# EAGLE schematic bezkontaktowy_miernik_odległości (EAGLE 9.7.0)
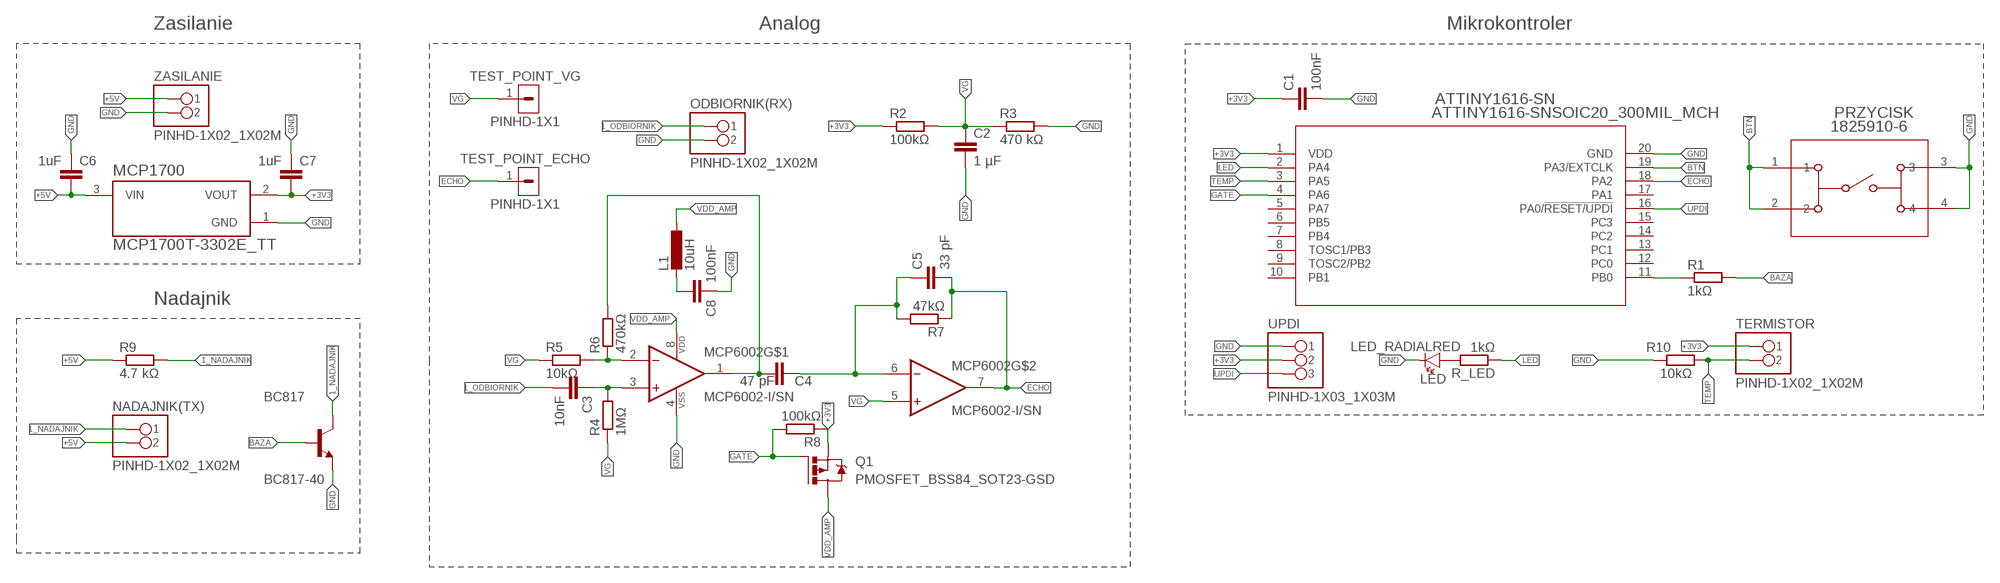
[diagram p0: schematic, sheet 1]

## Parts
ATTINY1616-SN  ATTINY1616-SNSOIC20_300MIL_MCH  [SOIC20_300MIL_MCH]
BC817  BC817-40  [SOT95P240X120-3N]
C1  100nF  C-EUC0603  [C0603]
C2  1 µF  C-EUC0603  [C0603]
C3  10nF  C-EUC0603  [C0603]
C4  47 pF  C-EUC0603  [C0603]
C5  33 pF  C-EUC0603  [C0603]
C6  1uF  C-EUC0603  [C0603]
C7  1uF  C-EUC0603  [C0603]
C8  100nF  C-EUC0603  [C0603]
L1  10uH  L-EU0204/7  [0204/7]
LED  LED_RADIALRED  [LEDRD254W60D565H860B_R]
MCP1700  MCP1700T-3302E_TT  [SOT95P237X112-3N]
MCP6002  MCP6002-I/SN  [SOIC127P600X175-8N]
NADAJNIK(TX)  PINHD-1X02_1X02M  [1X02]
ODBIORNIK(RX)  PINHD-1X02_1X02M  [1X02]
PRZYCISK  1825910-6  [SW4_1825910-B]
Q1  PMOSFET_BSS84_SOT23-GSD  [SOT23]
R1  1kΩ  R-EU_R0603  [R0603]
R2  100kΩ  R-EU_R0603  [R0603]
R3  470 kΩ  R-EU_R0603  [R0603]
R4  1MΩ  R-EU_R0603  [R0603]
R5  10kΩ  R-EU_R0603  [R0603]
R6  470kΩ  R-EU_R0603  [R0603]
R7  47kΩ  R-EU_R0603  [R0603]
R8  100kΩ  R-EU_R0603  [R0603]
R9  4.7 kΩ  R-EU_R0603  [R0603]
R10  10kΩ  R-EU_R0603  [R0603]
R_LED  1kΩ  R-EU_R0603  [R0603]
TERMISTOR  PINHD-1X02_1X02M  [1X02]
TEST_POINT_ECHO  PINHD-1X1  [1X01]
TEST_POINT_VG  PINHD-1X1  [1X01]
UPDI  PINHD-1X03_1X03M  [1X03]
ZASILANIE  PINHD-1X02_1X02M  [1X02]

## Nets
1_NADAJNIK: BC817.3(C) NADAJNIK(TX).1 R9.2
1_ODBIORNIK: C3.2 ODBIORNIK(RX).1
+3V3: ATTINY1616-SN.1(VDD) C1.1 C7.2 MCP1700.2(VOUT) Q1.2(S) R2.1 R8.1 TERMISTOR.1 UPDI.2
+5V: C6.2 MCP1700.3(VIN) NADAJNIK(TX).2 R9.1 ZASILANIE.1
BAZA: BC817.1(B) R1.2
BTN: ATTINY1616-SN.19(PA3/EXTCLK) PRZYCISK.1 PRZYCISK.2
ECHO: ATTINY1616-SN.18(PA2) C5.2 MCP6002.7(VOUTB) R7.1 TEST_POINT_ECHO.1
GATE: ATTINY1616-SN.4(PA6) Q1.1(G) R8.2
GND: ATTINY1616-SN.20(GND) BC817.2(E) C1.2 C2.2 C6.1 C7.1 C8.1 LED.C MCP1700.1(GND) MCP6002.4(VSS) ODBIORNIK(RX).2 PRZYCISK.3 PRZYCISK.4 R3.2 R10.1 UPDI.1 ZASILANIE.2
LED: ATTINY1616-SN.2(PA4) R_LED.1
N$1: C3.1 MCP6002.3(VINA+) R4.2
N$2: MCP6002.2(VINA-) R5.2 R6.1
N$3: C4.2 MCP6002.1(VOUTA) R6.2
N$4: LED.A R_LED.2
N$5: C4.1 C5.1 MCP6002.6(VINB-) R7.2
N$6: C8.2 L1.2
N$8: ATTINY1616-SN.11(PB0) R1.1
TEMP: ATTINY1616-SN.3(PA5) R10.2 TERMISTOR.2
UPDI: ATTINY1616-SN.16(PA0/!RESET/UPDI) UPDI.3
VDD_AMP: L1.1 MCP6002.8(VDD) Q1.3(D)
VG: C2.1 MCP6002.5(VINB+) R2.2 R3.1 R4.1 R5.1 TEST_POINT_VG.1
Unconnected: ATTINY1616-SN.5(PA7) ATTINY1616-SN.6(PB5) ATTINY1616-SN.7(PB4) ATTINY1616-SN.8(TOSC1/PB3) ATTINY1616-SN.9(TOSC2/PB2) ATTINY1616-SN.10(PB1) ATTINY1616-SN.12(PC0) ATTINY1616-SN.13(PC1) ATTINY1616-SN.14(PC2) ATTINY1616-SN.15(PC3) ATTINY1616-SN.17(PA1)

## Notes on the sheet
- Zasilanie | Analog | Mikrokontroler
- Nadajnik

## Library data of the parts
ATTINY1616-SN = ATTINY1616-SN:ATTINY1616-SN; COPYRIGHT: Copyright (C) 2025 Ultra Librarian. All rights reserved.; MANUFACTURER_NAME: Microchip; MANUFACTURER_PART_NUMBER: ATTINY1616-SN
BC817 = SnapEDA Library:BC817-40; MANUFACTURER: Diotec Semiconductor; MAXIMUM_PACKAGE_HEIGHT: 1.2mm; PARTREV: 2023-08-16; STANDARD: IPC 7351B
C1-C8 = rcl:C-EU: CAPACITOR, European symbol; SPICEPREFIX: C
L1 = rcl:L-EU: INDUCTOR, European symbol; SPICEPREFIX: L
LED = Opto-Electronic:LED_RADIAL: LED - Generic; CATEGORY: Optoelectronics; COLOR: Red; DESCRIPTION: Radial LED (Round) 2.54 mm pitch 5.65 mm body diameter 8.60 mm body height Red; PACKAGE_SIZE: 5mm; PACKAGE_TYPE: Through Hole; SUBCATEGORY: LED; TYPE: Round
MCP1700 = SnapEDA Library:MCP1700T-3302E_TT; MANUFACTURER: Microchip; MAXIMUM_PACKAGE_HEIGHT: 1.12 mm; PARTREV: E; SNAPEDA_PACKAGE_ID: 22705; SNAPEDA_PN: MCP1700T-3302E/TT; STANDARD: IPC 7351B
MCP6002 = SnapEDA Library:MCP6002-I/SN; MANUFACTURER: Microchip; MAXIMUM_PACKAGE_HEIGHT: 1.75 mm; PARTREV: L; SNAPEDA_PN: MCP6002T-I/SN; STANDARD: IPC-7351B
NADAJNIK(TX) ODBIORNIK(RX) TERMISTOR ZASILANIE = Tinkercad:PINHD-1X02
PRZYCISK = Switches:1825910-6; BUILT_BY: EMA_UL_Team; CATEGORY: Tactile Switches; CONFIGURATION__POLE-THROW_: Single Pole - Single Throw; COPYRIGHT: Copyright (C) 2016 Accelerated Designs. All rights reserved; DESCRIPTION: FSM4JH=6MM TACT SWITCH, HIGH TEMP; MANUFACTURER_PART_NUMBER: 1825910-6; MAX_SWITCHING_CURRENT: -; MAX_SWITCHING_VOLTAGE_AC_: -; PART_STATUS: active; PRODUCT_TYPE: Switch; SERIES: ?Alcoswitch FSM; SWITCH_TYPE: Tactile Switches; TE_PART_NUMBER: 1825910-6; VENDOR: TE Connectivity
Q1 = Transistor:PMOSFET_: P-Channel MOSFET - Popular parts; CATEGORY: Transistor; DATASHEET: https://www.onsemi.com/download/data-sheet/pdf/bss84-d.pdf; DESCRIPTION: P-Channel 50 V 130 mA (Ta) 225 mW (Ta) Surface Mount SOT-23-3 (TO-236); DRAIN_CURRENT: 130 mA; IC_MAX: NA; MANUFACTURER: onsemi; MPN: BSS84; OPERATING_TEMPERATURE: -55°C ~ 150°C; PACKAGE_SIZE: SOT23; PACKAGE_TYPE: Surface Mount; PART_STATUS: Active; ROHS: Compliant; SERIES: BSS84; SUBCATEGORY: MOSFET; THERMALLOSS: 0.36 W; TYPE: P-Channel; VCEO_MAX: NA
R1-R10 R_LED = rcl:R-EU_: RESISTOR, European symbol; SPICEPREFIX: R
TEST_POINT_ECHO TEST_POINT_VG = Connector:PINHD-1X1: Pin Header; CATEGORY: Connectors; DESCRIPTION: Header-Straight-1 Position; PACKAGE_TYPE: Through Hole; PITCH: 0.100" (2.54mm); SUBCATEGORY: Headers; TYPE: Male Pins
UPDI = Tinkercad:PINHD-1X03